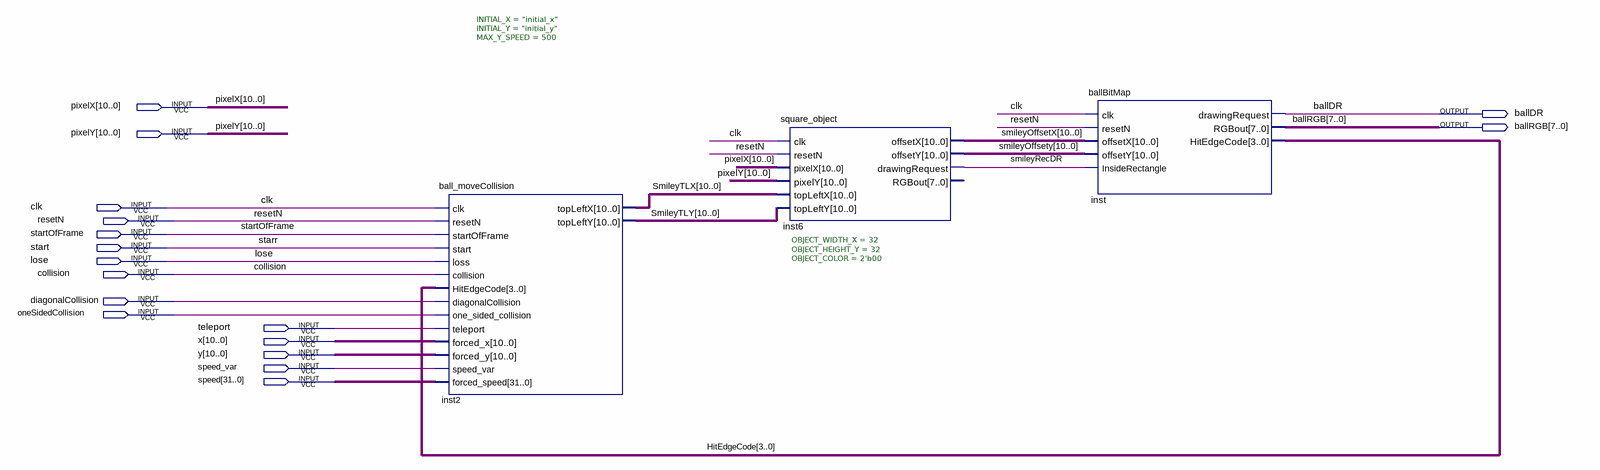
[diagram p0: schematic sheet]
// Quartus schematic Ball_Block.bdf as structural Verilog: 3 symbols, 17 pins
module Ball_Block (
  input  [10:0] pixelX,
  input  [10:0] pixelY,
  input  clk,
  input  resetN,
  input  startOfFrame,
  input  start,
  input  lose,
  input  collision,
  input  diagonalCollision,
  input  oneSidedCollision,
  input  teleport,
  input  [10:0] x,
  input  [10:0] y,
  input  speed_var,
  input  [31:0] speed,
  output ballDR,
  output [7:0] ballRGB
);

  wire smileyRecDR;
  wire [3:0] HitEdgeCode;
  wire [10:0] smileyOffsetX, smileyOffsety, SmileyTLX, SmileyTLY;

  ball_moveCollision #(.INITIAL_X("initial_x"), .INITIAL_Y("initial_y"), .MAX_Y_SPEED(500)) inst2 (
    .clk(clk), .resetN(resetN), .startOfFrame(startOfFrame), .start(start), .loss(lose),
    .collision(collision), .HitEdgeCode(HitEdgeCode), .diagonalCollision(diagonalCollision),
    .one_sided_collision(oneSidedCollision), .teleport(teleport), .forced_x(x), .forced_y(y),
    .speed_var(speed_var), .forced_speed(speed), .topLeftX(SmileyTLX), .topLeftY(SmileyTLY));
  square_object #(.OBJECT_WIDTH_X(32), .OBJECT_HEIGHT_Y(32), .OBJECT_COLOR(2'b00)) inst6 (
    .clk(clk), .resetN(resetN), .pixelX(pixelX), .pixelY(pixelY), .topLeftX(SmileyTLX), .topLeftY(SmileyTLY),
    .offsetX(smileyOffsetX), .offsetY(smileyOffsety), .drawingRequest(smileyRecDR));  // open: RGBout
  ballBitMap inst (
    .clk(clk), .resetN(resetN), .offsetX(smileyOffsetX), .offsetY(smileyOffsety),
    .InsideRectangle(smileyRecDR), .drawingRequest(ballDR), .RGBout(ballRGB), .HitEdgeCode(HitEdgeCode));

  // Other names for the same wires on the sheet: starr = start
endmodule
